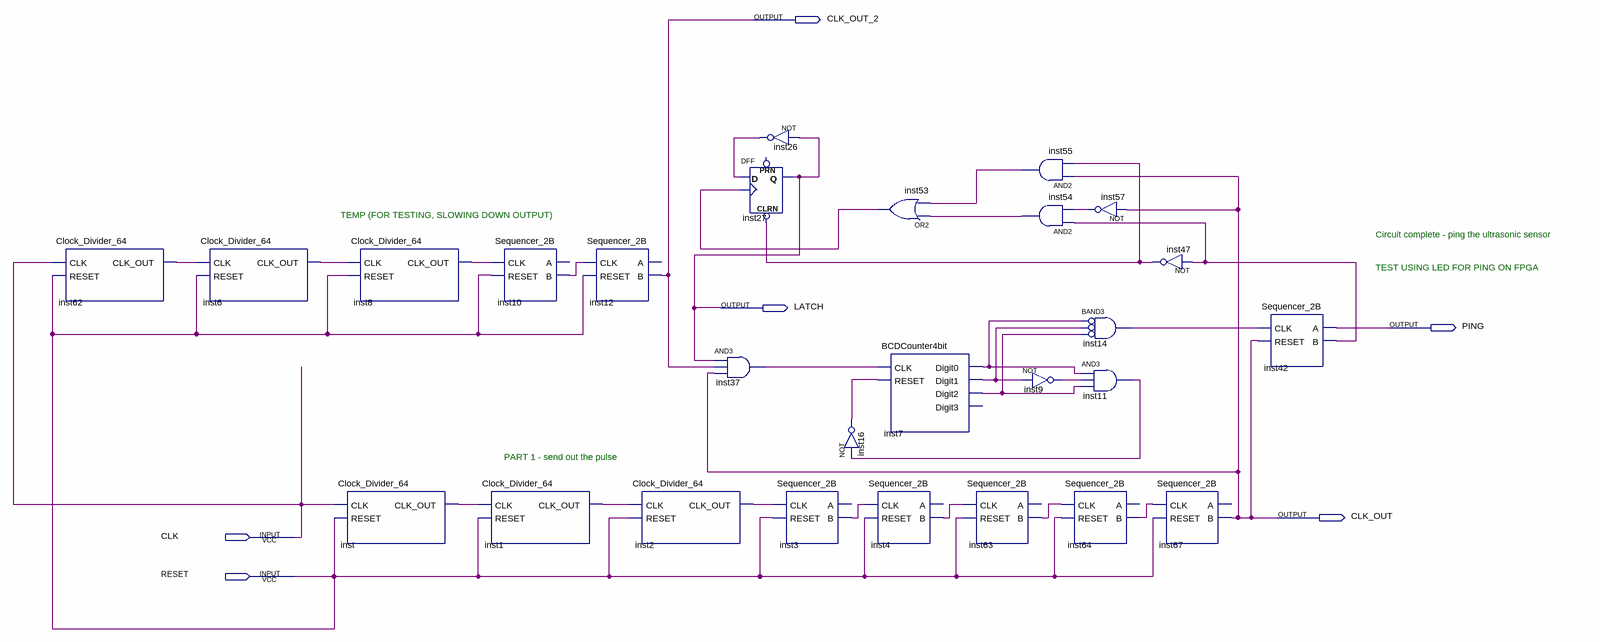
[diagram p0: schematic sheet]
// Quartus schematic controlultrasonicsensorv2.bdf as structural Verilog: 27 symbols, 6 pins
module controlultrasonicsensorv2 (
  input  CLK,
  input  RESET,
  output CLK_OUT_2,
  output LATCH,
  output PING,
  output CLK_OUT
);

  wire inst1_clk_out, inst2_clk_out, inst3_b, inst4_b, inst6_clk_out, inst7_digit0, inst7_digit1,
       inst7_digit2, inst8_clk_out, inst9_out, inst10_b, inst11_out, inst14_out, inst16_out, inst26_out,
       inst37_out, inst42_b, inst47_out, inst53_out, inst54_out, inst55_out, inst57_out, inst62_clk_out,
       inst63_b, inst64_b, inst_clk_out;

  Clock_Divider_64 inst62 (.CLK(CLK), .RESET(RESET), .CLK_OUT(inst62_clk_out));
  Clock_Divider_64 inst6 (.CLK(inst62_clk_out), .RESET(RESET), .CLK_OUT(inst6_clk_out));
  Clock_Divider_64 inst8 (.CLK(inst6_clk_out), .RESET(RESET), .CLK_OUT(inst8_clk_out));
  Clock_Divider_64 inst (.CLK(CLK), .RESET(RESET), .CLK_OUT(inst_clk_out));
  Clock_Divider_64 inst1 (.CLK(inst_clk_out), .RESET(RESET), .CLK_OUT(inst1_clk_out));
  Sequencer_2B inst10 (.CLK(inst8_clk_out), .RESET(RESET), .B(inst10_b));  // open: A
  Sequencer_2B inst12 (.CLK(inst10_b), .RESET(RESET), .B(CLK_OUT_2));  // open: A
  Clock_Divider_64 inst2 (.CLK(inst1_clk_out), .RESET(RESET), .CLK_OUT(inst2_clk_out));
  DFF inst27 (.CLRN(inst47_out), .CLK(inst53_out), .D(inst26_out), .Q(LATCH));  // open: PRN
  and inst37 (inst37_out, LATCH, CLK_OUT_2, CLK_OUT);
  not inst26 (inst26_out, LATCH);
  Sequencer_2B inst3 (.CLK(inst2_clk_out), .RESET(RESET), .B(inst3_b));  // open: A
  not inst16 (inst16_out, inst11_out);
  or inst53 (inst53_out, inst54_out, inst55_out);
  BCDCounter4bit inst7 (
    .CLK(inst37_out), .RESET(inst16_out), .Digit0(inst7_digit0), .Digit1(inst7_digit1), .Digit2(inst7_digit2));  // open: Digit3
  Sequencer_2B inst4 (.CLK(inst3_b), .RESET(RESET), .B(inst4_b));  // open: A
  Sequencer_2B inst63 (.CLK(inst4_b), .RESET(RESET), .B(inst63_b));  // open: A
  and inst55 (inst55_out, CLK_OUT, inst47_out);
  and inst54 (inst54_out, inst42_b, inst57_out);
  not inst9 (inst9_out, inst7_digit1);
  Sequencer_2B inst64 (.CLK(inst63_b), .RESET(RESET), .B(inst64_b));  // open: A
  not inst57 (inst57_out, CLK_OUT);
  and inst14 (inst14_out, ~inst7_digit0, ~inst7_digit1, ~inst7_digit2);  // BAND3
  and inst11 (inst11_out, inst7_digit0, inst9_out, inst7_digit2);
  not inst47 (inst47_out, inst42_b);
  Sequencer_2B inst67 (.CLK(inst64_b), .RESET(RESET), .B(CLK_OUT));  // open: A
  Sequencer_2B inst42 (.CLK(inst14_out), .RESET(CLK_OUT), .A(PING), .B(inst42_b));

  // Notes on the sheet:
  //   TEMP (FOR TESTING, SLOWING DOWN OUTPUT)
  //   Circuit complete - ping the ultrasonic sensor
  //   TEST USING LED FOR PING ON FPGA
  //   PART 1 - send out the pulse
endmodule
